# Altium project SVEC.PrjPcb (part 5 of 11)

## Sheet USB_interface.SchDoc: USB interface
size 420 x 297 mm; CheckedBy: T.Janicki; CompanyName: Creotech Instruments SA; DrawnBy: G. Kasprowicz; Organization: CERN; Address1: European Organization for Nuclear Research; Address2: CH-1211 Geneve 23 - Switzerland; DocumentNumber: 10; Revision: -; SheetNumber: 17; SheetTotal: 19; EDA_Number: EDA-xxxx; Projet: Simple VME FMC Carrier; CreateDate: 20/11/2012; CheckedDate: 23/01/2012; DivGrp: BE-CO; Designer: G.Kasprowicz; DocumentName: USB.SchDoc; ModifiedDate: -; Rule: PcbType=ProtelPcb
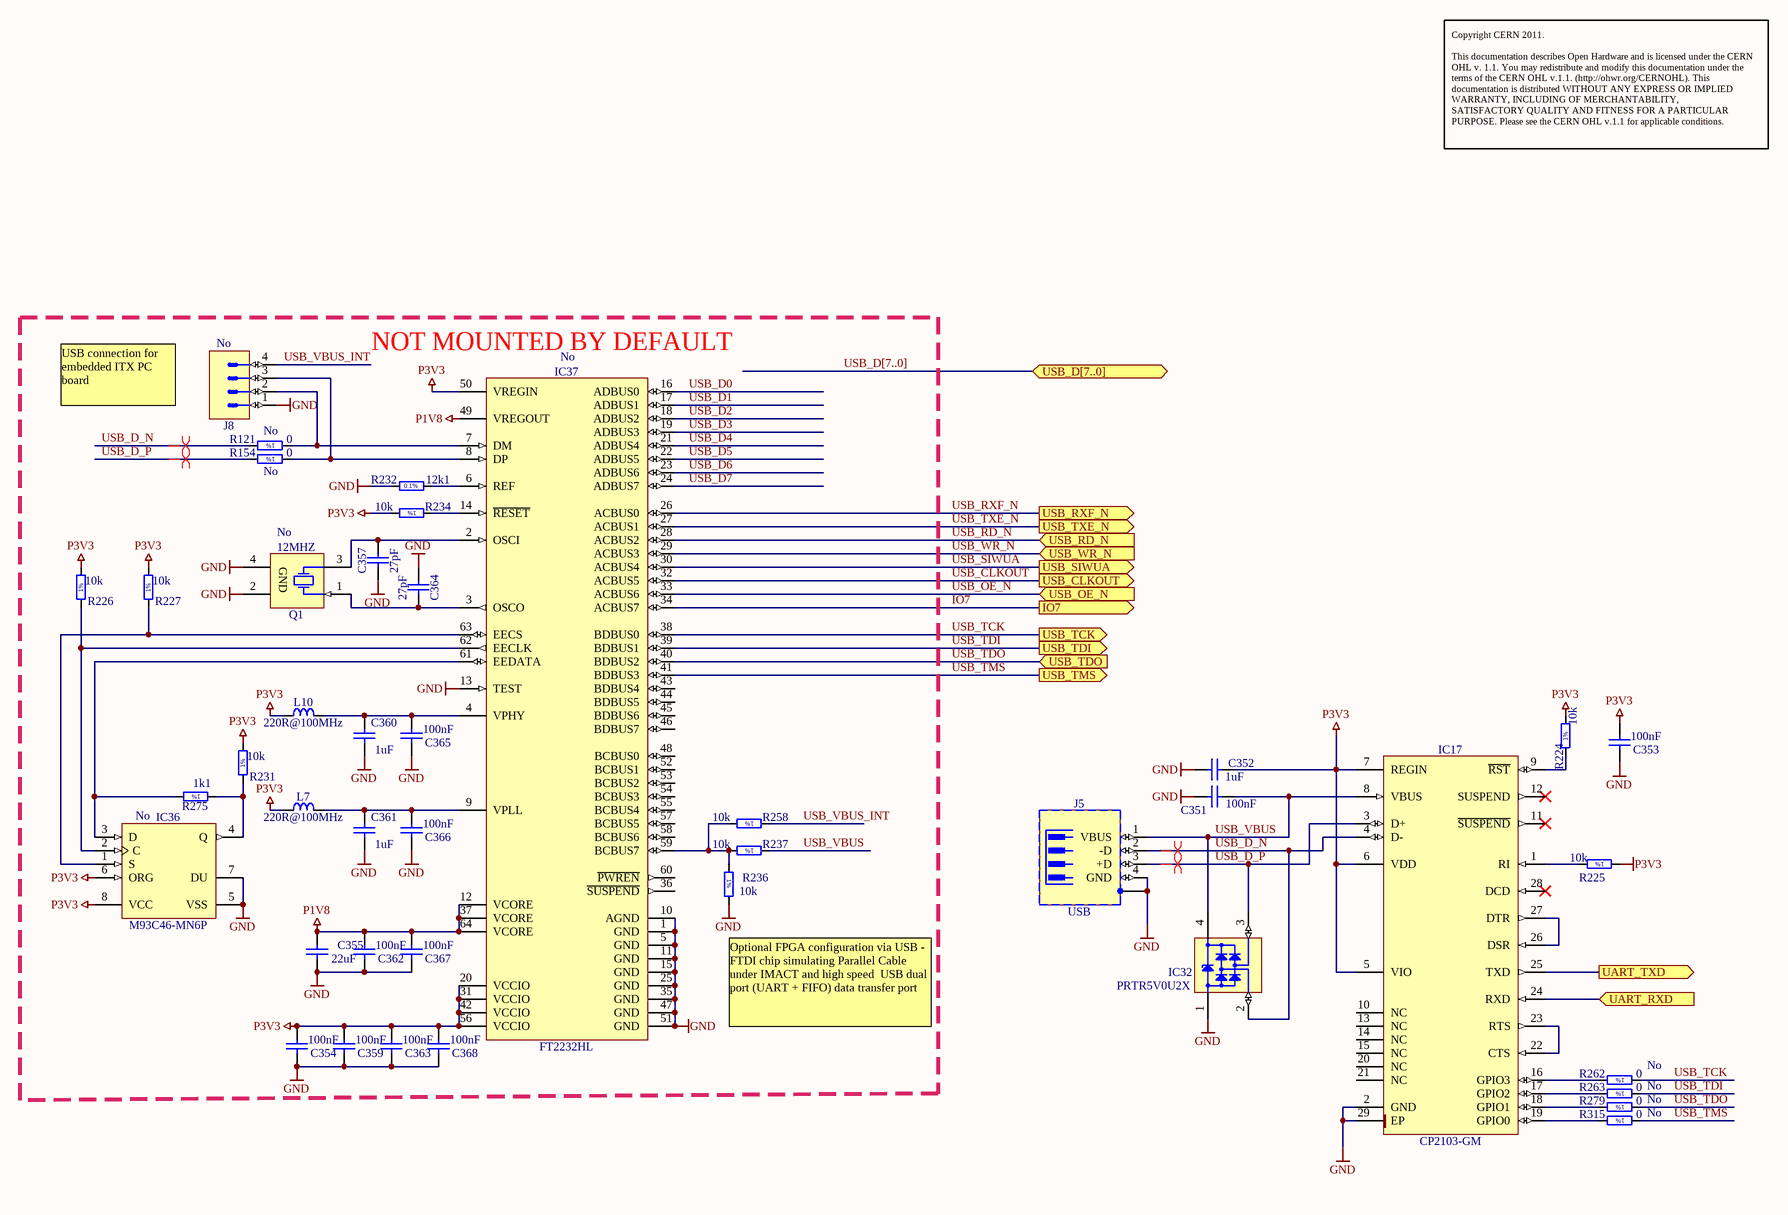
[diagram p6: USB_interface.SchDoc]

### Parts
C351  100nF  [CAPC1005X55N]
C352  1uF  [CAPC1608X87N]
C353  100nF  [CAPC1005X55N]
C354  100nF  [CAPC1005X55N]
C355  22uF  [CAPC3216X180N]
C357  27pF  [CAPC1608X87N]
C359  100nF  [CAPC1005X55N]
C360  1uF  [CAPC1608X87N]
C361  1uF  [CAPC1608X87N]
C362  100nF  [CAPC1005X55N]
C363  100nF  [CAPC1005X55N]
C364  27pF  [CAPC1608X87N]
C365  100nF  [CAPC1005X55N]
C366  100nF  [CAPC1005X55N]
C367  100nF  [CAPC1005X55N]
C368  100nF  [CAPC1005X55N]
IC17  CP2103-GM  [QFN50P500X500X100-29N-S335]
IC32  PRTR5V0U2X  [SOT190P230X110-4N]
IC36  M93C46-MN6P  Mounted: No  [SOIC127P600X175-8N]
IC37  FT2232HL  Mounted: No  [QFP50P1200X1200X160-64N]
J5  USB  [TYCO_292304-1]
J8  Mounted: No  [MOLEX_22-04-1041]  (hidden comment: KK®)
L7  220R@100MHz  [INDC2012X105N]
L10  220R@100MHz  [INDC2012X105N]
Q1  12MHZ  Mounted: No  [XTAL_ABRACON_ABM3B]
R121  0  Mounted: No  [RESC1608X55N]
R154  0  Mounted: No  [RESC1608X55N]
R224  10k  [RESC1608X55N]
R225  10k  [RESC1608X55N]
R226  10k  [RESC1608X55N]
R227  10k  [RESC1608X55N]
R231  10k  [RESC1608X55N]
R232  12k1  [RESC1608X55N]
R234  10k  [RESC1608X55N]
R236  10k  [RESC1608X55N]
R237  10k  [RESC1608X55N]
R258  10k  [RESC1608X55N]
R262  0  Mounted: No  [RESC1608X55N]
R263  0  Mounted: No  [RESC1608X55N]
R275  1k1  [RESC1608X55N]
R279  0  Mounted: No  [RESC1608X55N]
R315  0  Mounted: No  [RESC1608X55N]

### Blocks framed on the sheet
NOT MOUNTED BY DEFAULT: C354 C355 C357 C359-C368 IC36 IC37 J8 L7 L10 Q1 R121 R154 R226 R227 R231 R232 R234 R236 R237 R258 R275

### Ports
IO7 (out), UART_RXD (in), UART_TXD (out), USB_CLKOUT (out), USB_D[7..0] (bidir), USB_OE_N (in), USB_RD_N (in), USB_RXF_N (out), USB_SIWUA (out), USB_TCK (out), USB_TDI (out), USB_TDO (in), USB_TMS (out), USB_TXE_N (out), USB_WR_N (in)

### Nets
GND: C351.2 C352.2 C353.2 C354.2 C355.1 C357.1 C359.2 C360.1 C361.1 C362.2 C363.2 C364.1 C365.2 C366.2 C367.2 C368.2 IC17.2(GND) IC17.29(EP) IC32.1(GND) IC36.5(VSS) IC36.7(DU) IC37.1(GND) IC37.5(GND) IC37.10(AGND) IC37.11(GND) IC37.13(TEST) IC37.15(GND) IC37.25(GND) IC37.35(GND) IC37.47(GND) IC37.51(GND) J5.4(GND) J5.5(SH) J8.1 Q1.2(GND) Q1.4(GND) R232.1 R236.2
P1V8: C355.2 C362.1 C367.1 IC37.12(VCORE) IC37.37(VCORE) IC37.49(VREGOUT) IC37.64(VCORE)
P3V3: C352.1 C353.1 C354.1 C359.1 C363.1 C368.1 IC17.5(VIO) IC17.6(VDD) IC17.7(REGIN) IC36.6(ORG) IC36.8(VCC) IC37.20(VCCIO) IC37.31(VCCIO) IC37.42(VCCIO) IC37.50(VREGIN) IC37.56(VCCIO) L7.1 L10.1 R224.2 R225.1 R226.2 R227.2 R231.2 R234.2
IO7: IC37.34(ACBUS7) ; port IO7
UART_RXD: IC17.24(RXD) ; port UART_RXD
UART_TXD: IC17.25(TXD) ; port UART_TXD
USB_CLKOUT: IC37.32(ACBUS5) ; port USB_CLKOUT
USB_D0: IC37.16(ADBUS0)
USB_D1: IC37.17(ADBUS1)
USB_D2: IC37.18(ADBUS2)
USB_D3: IC37.19(ADBUS3)
USB_D4: IC37.21(ADBUS4)
USB_D5: IC37.22(ADBUS5)
USB_D6: IC37.23(ADBUS6)
USB_D7: IC37.24(ADBUS7)
USB_D_N: IC17.4(D-) IC32.2(I/O1) J5.2(-D) R121.2
USB_D_P: IC17.3(D+) IC32.3(I/O2) J5.3(+D) R154.2
USB_OE_N: IC37.33(ACBUS6) ; port USB_OE_N
USB_RD_N: IC37.28(ACBUS2) ; port USB_RD_N
USB_RXF_N: IC37.26(ACBUS0) ; port USB_RXF_N
USB_SIWUA: IC37.30(ACBUS4) ; port USB_SIWUA
USB_TCK: IC37.38(BDBUS0) R262.1 ; port USB_TCK
USB_TDI: IC37.39(BDBUS1) R263.1 ; port USB_TDI
USB_TDO: IC37.40(BDBUS2) R279.1 ; port USB_TDO
USB_TMS: IC37.41(BDBUS3) R315.1 ; port USB_TMS
USB_TXE_N: IC37.27(ACBUS1) ; port USB_TXE_N
USB_VBUS: C351.1 IC17.8(VBUS) IC32.4(VCC) J5.1(VBUS) R237.1
USB_VBUS_INT: J8.4 R258.1
USB_WR_N: IC37.29(ACBUS3) ; port USB_WR_N
NetC357_2: C357.2 IC37.2(OSCI) Q1.3(X)
NetC360_2: C360.2 C365.1 IC37.4(VPHY) L10.2
NetC361_2: C361.2 C366.1 IC37.9(VPLL) L7.2
NetC364_2: C364.2 IC37.3(OSCO) Q1.1(X)
NetIC17_1: IC17.1(RI) R225.2
NetIC17_9: IC17.9(~{RST}) R224.1
NetIC17_16: IC17.16(GPIO3) R262.2
NetIC17_17: IC17.17(GPIO2) R263.2
NetIC17_18: IC17.18(GPIO1) R279.2
NetIC17_19: IC17.19(GPIO0) R315.2
NetIC17_22: IC17.22(CTS) IC17.23(RTS)
NetIC17_26: IC17.26(DSR) IC17.27(DTR)
NetIC36_1: IC36.1(S) IC37.63(EECS) R227.1
NetIC36_2: IC36.2(C) IC37.62(EECLK) R226.1
NetIC36_3: IC36.3(D) IC37.61(EEDATA) R275.2
NetIC36_4: IC36.4(Q) R231.1 R275.1
NetIC37_6: IC37.6(REF) R232.2
NetIC37_7: IC37.7(DM) J8.2 R121.1
NetIC37_8: IC37.8(DP) J8.3 R154.1
NetIC37_14: IC37.14(~{RESET}) R234.1
NetIC37_59: IC37.59(BCBUS7) R236.1 R237.2 R258.2

Not connected (* = marked no-connect by the designer): IC17 10(NC) 11(~{SUSPEND})* 12(SUSPEND)* 13(NC) 14(NC) 15(NC) 20(NC) 21(NC) 28(DCD)*; IC37 36(~{SUSPEND}) 43(BDBUS4) 44(BDBUS5) 45(BDBUS6) 46(BDBUS7) 48(BCBUS0) 52(BCBUS1) 53(BCBUS2) 54(BCBUS3) 55(BCBUS4) 57(BCBUS5) 58(BCBUS6) 60(~{PWREN})

### Buses and harness runs
bus USB_D[7..0] = port USB_D[7..0]

### Layout directives
differential pair: USB_D_N, USB_D_P

### Notes on the sheet
- Copyright CERN 2011.
  This documentation describes Open Hardware and is licensed under the CERN OHL v. 1.1. You may redistribute and modify this documentation under the terms of the CERN OHL v.1.1. (http://ohwr.org/CERNOHL). This documentation is distributed WITHOUT ANY EXPRESS OR IMPLIED WARRANTY, INCLUDING OF MERCHANTABILITY, SATISFACTORY QUALITY AND FITNESS FOR A PARTICULAR PURPOSE. Please see the CERN OHL v.1.1 for applicable conditions.
- USB connection for embedded ITX PC board
- (near R236) Optional FPGA configuration via USB - FTDI chip simulating Parallel Cable under IMACT and high speed  USB dual port (UART + FIFO) data transfer port
- Project/Equipment
- Document
- Designer
- Drawn by
- Check.by
- File
- Last Mod.
- Print Date
- Sheet
- Size
- A3
- of
- Rev
- (in symbol R0603_0R_JUMPER) 1%
- (in symbol R0603_1K1_1%_0.1W_100PPM) 1%
- (in symbol R0603_10K_1%_0.1W_100PPM) 1%
- (in symbol R0603_12K1_0.1%_0.063W_10PPM) 0.1%

### Library data of the parts
C351 C353 = CC0402_100NF_16V_10%_X7R: Non-polarised capacitor; Part Description: SMD Multilayer Chip Ceramic Capacitor; Manufacturer: GENERIC; Manufacturer1 Part Number: 223878715649; Voltage: 16V; TC: X7R; Tolerance: ±10%; Table: Capacitors SMD; Part Number: CC0402_100NF_16V_10%_X7R; Component Kind: Standard; Component Type: Standard; Pin Count: 2; Value: 100nF; Status: Not Recommended; Manufacturer Part Number: CC0402_100NF_16V_10%_X7R; Case: 0402; Mounted: Yes; Socket: No; SMD: Yes; Manufacturer1 Example: PHYCOMP; Manufacturer1 ComponentHeight: 0.55mm; HelpURL: \\cern.ch\dfs\Applications\Altium\Datasheets\CC0402_X7R_PHYCOMP.pdf; Author: CERN DEM JLC; CreateDate: 03/12/2007; LatestRevisionDate: 03/12/2007
C352 = CC0603_1UF_16V_10%_X7R: Non-polarised capacitor; Part Description: SMD Multilayer Chip Ceramic Capacitor; Manufacturer: GENERIC; Manufacturer1 Part Number: 223824613663; Voltage: 16V; TC: X7R; Tolerance: ±10%; Table: Capacitors SMD; Part Number: CC0603_1UF_16V_10%_X7R; Component Kind: Standard; Component Type: Standard; Pin Count: 2; Value: 1uF; Status: Preferred; Manufacturer Part Number: CC0603_1uF_16V_10%_X7R; Case: 0603; Mounted: Yes; Socket: No; SMD: Yes; Manufacturer1 Example: PHYCOMP; Manufacturer1 ComponentHeight: 0.87mm; HelpURL: \\cern.ch\dfs\Applications\Altium\Datasheets\CC0805_X5R_PHYCOMP_HC.pdf; Author: CERN DEM JLC; CreateDate: 12/3/2007; LatestRevisionDate: 12/3/2007
C354 C359 C362 C363 C365-C368 = CC0402_100NF_16V_10%_X7R: Non-polarised capacitor; Part Description: SMD Multilayer Chip Ceramic Capacitor; Manufacturer: GENERIC; Manufacturer1 Part Number: 223878715649; Voltage: 16V; TC: X7R; Tolerance: ±10%; Mounted: No; Table: Capacitors SMD; Part Number: CC0402_100NF_16V_10%_X7R; Component Kind: Standard; Component Type: Standard; Pin Count: 2; Value: 100nF; Status: Not Recommended; Manufacturer Part Number: CC0402_100NF_16V_10%_X7R; Case: 0402; Socket: No; SMD: Yes; Manufacturer1 Example: PHYCOMP; Manufacturer1 ComponentHeight: 0.55mm; HelpURL: \\cern.ch\dfs\Applications\Altium\Datasheets\CC0402_X7R_PHYCOMP.pdf; Author: CERN DEM JLC; CreateDate: 03/12/2007; LatestRevisionDate: 03/12/2007
C355 = CC1206_22UF_10V_10%_X7R: Non-polarised capacitor; Part Description: SMD Multilayer Chip Ceramic Capacitor; Manufacturer: GENERIC; Manufacturer1 Part Number: GRM31CR71A226KE15L; Voltage: 10V; TC: X7R; Tolerance: ±10%; Mounted: No; Table: Capacitors SMD; Part Number: CC1206_22UF_10V_10%_X7R; Component Kind: Standard; Component Type: Standard; Pin Count: 2; Value: 22uF; Status: Preferred; Manufacturer Part Number: CC1206_22UF_10V_10%_X7R; Case: 1206; Socket: No; SMD: Yes; Manufacturer1 Example: MURATA; Manufacturer1 ComponentHeight: 1.8mm; HelpURL: \\cern.ch\dfs\Applications\Altium\Datasheets\CC1206_X7R_MURATA_GRM-HI-CAP.pdf; Author: CERN DEM JLC; CreateDate: 2010-06-08; LatestRevisionDate: 2010-06-08
C357 C364 = CC0603_27PF_50V_5%_NP0: Non-polarised capacitor; Part Description: SMD Multilayer Chip Ceramic Capacitor; Manufacturer: GENERIC; Manufacturer1 Part Number: 223886715279; Voltage: 50V; TC: NP0; Tolerance: ±5%; Mounted: No; Table: Capacitors SMD; Part Number: CC0603_27PF_50V_5%_NP0; Component Kind: Standard; Component Type: Standard; Pin Count: 2; Value: 27pF; Status: Preferred; Manufacturer Part Number: CC0603_27PF_50V_5%_NP0; Case: 0603; Socket: No; SMD: Yes; Manufacturer1 Example: PHYCOMP; Manufacturer1 ComponentHeight: 0.87mm; HelpURL: \\cern.ch\dfs\Applications\Altium\Datasheets\CC0603_NP0_PHYCOMP.pdf; Author: CERN DEM JLC; CreateDate: 2007-12-03; LatestRevisionDate: 2007-12-03
C360 C361 = CC0603_1UF_16V_10%_X7R: Non-polarised capacitor; Part Description: SMD Multilayer Chip Ceramic Capacitor; Manufacturer: GENERIC; Manufacturer1 Part Number: 223824613663; Voltage: 16V; TC: X7R; Tolerance: ±10%; Mounted: No; Table: Capacitors SMD; Part Number: CC0603_1UF_16V_10%_X7R; Component Kind: Standard; Component Type: Standard; Pin Count: 2; Value: 1uF; Status: Preferred; Manufacturer Part Number: CC0603_1uF_16V_10%_X7R; Case: 0603; Socket: No; SMD: Yes; Manufacturer1 Example: PHYCOMP; Manufacturer1 ComponentHeight: 0.87mm; HelpURL: \\cern.ch\dfs\Applications\Altium\Datasheets\CC0805_X5R_PHYCOMP_HC.pdf; Author: CERN DEM JLC; CreateDate: 03/12/2007; LatestRevisionDate: 03/12/2007
IC17 = CP2103-GM: Single-Chip USB to UART Bridge; Manufacturer: SILICON LABS; Table: Analog & Interface; Part Number: CP2103-GM; Component Kind: Standard; Component Type: Standard; Device: CP2103-GM; PackageDescription: QFN, 0.50mm Pitch, Square; 28 pin, 5.00mm L X 5.00mm W X 1.00mm H body (w/thermal tab 3.35 X 3.35mm),  IPC Medium Density; Part Description: Single-Chip USB to UART Bridge; Manufacturer Part Number: CP2103-GM; Pin Count: 29; Case: QFN28; Mounted: Yes; Socket: No; SMD: Yes; ComponentHeight: 1.0mm; Author: CERN DEM JLC; HelpURL: \\cern.ch\dfs\Applications\Altium\Datasheets\CP2103-GM.pdf; CreateDate: 2011-08-17; LatestRevisionDate: 2011-08-17
IC32 = PRTR5V0U2X: Ultra Low Capacitance Double Rail-to-Rail ESD Protection Diode; Part Description: Ultra Low Capacitance (1pF) Double Rail-to-Rail ESD Protection Diode (8kV); Manufacturer: PHILIPS NXP; Voltage: 5.5V; Table: Diodes; Part Number: PRTR5V0U2X; Component Kind: Standard; Component Type: Standard; Device: PRTR5V0U2X; PackageDescription: SOT143B, SOT, 1.90mm Pitch; 4 Pin, 1.30mm W X 2.90mm L X 1.10mm H body, IPC Medium Density; Manufacturer Part Number: PRTR5V0U2X; Pin Count: 4; Case: SOT143B; Mounted: Yes; Socket: No; SMD: Yes; ComponentHeight: 1.1mm; HelpURL: \\cern.ch\dfs\Applications\Altium\Datasheets\PRTR5V0U2X.pdf; Author: CERN DEM JLC; CreateDate: 3/22/2011; LatestRevisionDate: 3/22/2011
IC36 = M93C46-MN6P: 1Kb (x8/x16) Serial Microwire Bus EEPROM; Part Description: 1K (128 x 8 or 64 x 16 bit) Serial Microwire Bus EEPROM; Manufacturer: ST MICROELECTRONICS; Table: Logic; Part Number: M93C46-MN6P; Component Kind: Standard; Component Type: Standard; Device: M93C46-MN6P; PackageDescription: SOIC 8, Pitch 1.27mm - Body 4x5mm, IPC Medium Density; Manufacturer Part Number: M93C46-MN6P; Pin Count: 8; Case: SOIC8; Socket: No; SMD: Yes; ComponentHeight: 1.75mm; HelpURL: \\cern.ch\dfs\Applications\Altium\Datasheets\M93C46-MN6P.pdf; Author: CERN DEM JLC; CreateDate: 2008-09-09; LatestRevisionDate: 2008-09-09
IC37 = FT2232HL: Dual High Speed USB to Multipurpose UART/FIFO IC; Manufacturer: FUTURE TECHNOLOGY DEVICES INTERNATIONAL (FTDI); Table: Analog & Interface; Part Number: FT2232HL; Component Kind: Standard; Component Type: Standard; Device: FT2232HL; PackageDescription: QFP, 0.50mm pitch, square; 16 pin X 16 pin, 10.00mm X 10.00mm X 1.60mm Body, IPC Medium Density; Part Description: Dual High Speed USB to Multipurpose UART/FIFO IC; Manufacturer Part Number: FT2232HL; Pin Count: 64; Case: QFP64; Socket: No; SMD: Yes; ComponentHeight: 1.6mm; Author: CERN DEM JLC; HelpURL: \\cern.ch\dfs\Applications\Altium\Datasheets\FT2232HL.pdf; CreateDate: 2011-12-06; LatestRevisionDate: 2011-12-06
J5 = TYCO_292304-1: 4 Pin + 1 Shield USB Receptacle; Part Description: Thru Hole, Right Angle, 4 Position, Type B, USB Receptacle; Manufacturer: TYCO ELECTRONICS; Table: TYCO; Part Number: TYCO_292304-1; Component Kind: Standard; Component Type: Standard; Pin Count: 5; Family: USB; Mounted: Yes; Socket: No; SMD: No; Status: None; Manufacturer Part Number: 292304-1; ComponentHeight: 11.5mm; HelpURL: \\cern.ch\dfs\Applications\Altium\Datasheets\TYCO_292304-1.pdf; Author: CERN DEM JLC; CreateDate: 2010-07-16; LatestRevisionDate: 2010-07-16
J8 = MOLEX_22-04-1041: Connector 4 Male; Part Description: 2.5mm (.100") Pitch KK® Wire-to-Board Header, Vertical, with Friction Lock, 4 Circuits, Tin (Sn) Plating; Manufacturer: MOLEX; Part Number: MOLEX_22-04-1041; Component Kind: Standard; Component Type: Standard; Pin Count: 4; Family: KK®; Socket: No; SMD: No; Status: None; Manufacturer Part Number: 22-04-1041; ComponentHeight: 11.7mm; HelpURL: \\cern.ch\dfs\Applications\Altium\Datasheets\MOLEX_22-04-1041.pdf; Author: CERN DEM JLC; CreateDate: 2012-02-09; LatestRevisionDate: 2012-02-09; Table: MOLEX
L7 L10 = IND0805_MURATA_BLM21PG221SN1D: Inductor; Part Description: SMD EMIFIL Suppression Chip Bead Ferrite; Manufacturer: MURATA; Power: 2A; Resistance: 0.05R; Tolerance: ±25%; Mounted: No; Table: Inductors SMD; Part Number: IND0805_MURATA_BLM21PG221SN1D; Component Kind: Standard; Component Type: Standard; Pin Count: 2; Value: 220R@100MHz; Status: None; Manufacturer Part Number: BLM21PG221SN1D; Case: 0805; Socket: No; SMD: Yes; ComponentHeight: 1.05mm; HelpURL: \\cern.ch\dfs\Applications\Altium\Datasheets\IND0402_MURATA_BLM21P.pdf; Author: CERN DEM JLC; CreateDate: 25/01/2010; LatestRevisionDate: 25/01/2010
Q1 = XTAL_12MHZ_ABRACON_ABM3B-12.000MHZ-B2-T: Crystal 4 pins 1=XTAL Control 2=GND3=XTAL 4=GND; Part Description: Tolerance:± 20ppm, Stability:± 50ppm, -20°C to +70°C, 18pF, Ceramic SMD Crystal, ABM3B Serie; Table: Crystals & Oscillators; Part Number: XTAL_12MHZ_ABRACON_ABM3B-12.000MHZ-B2-T; Component Kind: Standard; Component Type: Standard; PackageDescription: ABM3B Serie, SMD Cristal, Body 5.x3.2mm; Value: 12MHZ; Manufacturer: ABRACON; Manufacturer Part Number: ABM3B-12.000MHZ-B2-T; Pin Count: 2; Socket: No; SMD: Yes; ComponentHeight: 1.1mm; HelpURL: \\cern.ch\dfs\Applications\Altium\Datasheets\XTAL_ABRACON_ABM3B.pdf; Author: CERN DEM JLC; CreateDate: 2012-03-06; LatestRevisionDate: 2012-03-06
R121 R154 R262 R263 R279 R315 = R0603_0R_JUMPER: Resistor - 1%; Part Description: 1A (0.05R Max DC Resistance) Zero Ohm Jumper; Manufacturer: GENERIC; Manufacturer1 Part Number: NRC06Z0; Table: Resistors SMD; Part Number: R0603_0R_JUMPER; Component Kind: Standard; Component Type: Standard; Pin Count: 2; Value: 0; Status: Preferred; Manufacturer Part Number: R0603_0R_JUMPER; Case: 0603; Socket: No; SMD: Yes; Manufacturer1 Example: NIC COMPONENT; Manufacturer1 ComponentHeight: 0.55mm; HelpURL: \\cern.ch\dfs\Applications\Altium\Datasheets\R0603_NIC_NRC.pdf; Author: CERN DEM JLC; CreateDate: 12/3/2007; LatestRevisionDate: 3/13/2008
R224 R225 = R0603_10K_1%_0.1W_100PPM: Resistor - 1%; Part Description: General Purpose Thick Film Chip Resistor; Manufacturer: GENERIC; Manufacturer1 Part Number: NRC06F1002TRF; Power: 0.1W; TC: ±100ppm/°C; Table: Resistors SMD; Part Number: R0603_10K_1%_0.1W_100PPM; Component Kind: Standard; Component Type: Standard; Pin Count: 2; Value: 10k; Status: Preferred; Tolerance: ±1%; Manufacturer Part Number: R0603_10K_1%_0.1W_100PPM; Case: 0603; Mounted: Yes; Socket: No; SMD: Yes; Manufacturer1 Example: NIC COMPONENT; Manufacturer1 ComponentHeight: 0.55mm; HelpURL: \\cern.ch\dfs\Applications\Altium\Datasheets\R0603_NIC_NRC.pdf; Author: CERN DEM JLC; CreateDate: 12/3/2007; LatestRevisionDate: 3/13/2008
R226 R227 R231 R234 R236 R237 R258 = R0603_10K_1%_0.1W_100PPM: Resistor - 1%; Part Description: General Purpose Thick Film Chip Resistor; Manufacturer: GENERIC; Manufacturer1 Part Number: NRC06F1002TRF; Power: 0.1W; TC: ±100ppm/°C; Mounted: No; Table: Resistors SMD; Part Number: R0603_10K_1%_0.1W_100PPM; Component Kind: Standard; Component Type: Standard; Pin Count: 2; Value: 10k; Status: Preferred; Tolerance: ±1%; Manufacturer Part Number: R0603_10K_1%_0.1W_100PPM; Case: 0603; Socket: No; SMD: Yes; Manufacturer1 Example: NIC COMPONENT; Manufacturer1 ComponentHeight: 0.55mm; HelpURL: \\cern.ch\dfs\Applications\Altium\Datasheets\R0603_NIC_NRC.pdf; Author: CERN DEM JLC; CreateDate: 12/3/2007; LatestRevisionDate: 3/13/2008
R232 = R0603_12K1_0.1%_0.063W_10PPM: Resistor - 0.1%; Part Description: Thin Film Chip Resistor; Manufacturer: GENERIC; Manufacturer1 Part Number: RN73C1J12K1BTDF; Power: 0.063W; TC: ±10ppm; Mounted: No; Table: Resistors SMD; Part Number: R0603_12K1_0.1%_0.063W_10PPM; Component Kind: Standard; Component Type: Standard; Pin Count: 2; Value: 12k1; Status: Not recommended; Tolerance: ±0.1%; Manufacturer Part Number: R0603_12K1_0.1%_0.063W_10PPM; Case: 0603; Socket: No; SMD: Yes; Manufacturer1 Example: TYCO HOLSWORTHY; Manufacturer1 ComponentHeight: 0.5mm; HelpURL: \\cern.ch\dfs\Applications\Altium\Datasheets\R0603_Tyco_RN73.pdf; Author: CERN DEM JLC; CreateDate: 2007-12-03; LatestRevisionDate: 2008-03-13
R275 = R0603_1K1_1%_0.1W_100PPM: Resistor - 1%; Part Description: General Purpose Thick Film Chip Resistor; Manufacturer: GENERIC; Manufacturer1 Part Number: NRC06F1101TRF; Power: 0.1W; TC: ±100ppm/°C; Mounted: No; Table: Resistors SMD; Part Number: R0603_1K1_1%_0.1W_100PPM; Component Kind: Standard; Component Type: Standard; Pin Count: 2; Value: 1k1; Status: Preferred; Tolerance: ±1%; Manufacturer Part Number: R0603_1K1_1%_0.1W_100PPM; Case: 0603; Socket: No; SMD: Yes; Manufacturer1 Example: NIC COMPONENT; Manufacturer1 ComponentHeight: 0.55mm; HelpURL: \\cern.ch\dfs\Applications\Altium\Datasheets\R0603_NIC_NRC.pdf; Author: CERN DEM JLC; CreateDate: 2007-12-03; LatestRevisionDate: 2008-03-13

## Sheet AFPGA.SchDoc: Application FPGA
size 420 x 297 mm; CheckedBy: T.Janicki; CompanyName: Creotech Instruments SA; DrawnBy: G.Kasprowicz; Organization: CERN; Address1: European Organization for Nuclear Research; Address2: CH-1211 Geneve 23 - Switzerland; Revision: -; SheetNumber: 2; SheetTotal: 21; EDA_Number: EDA-xxxx; Projet: Simple VME FMC Carrier; ModifiedBy: -; CreateDate: 20/11/2012; CheckedDate: 30/04/2012; DivGrp: BE-CO; Designer: G.Kasprowicz; PageSetup: Record=PageOptions|CenterHorizontal=True|CenterVertical=True|PrintScale=0.95|XCorrection=1.00|YCorrection=1.00|PrintKind=1|BorderSize=5000000|LeftOffset=0|BottomOffset=0|Orientation=2|PaperLength=1000|PaperWidth=1000|Scale=100|PaperSource=15|PrintQuality=600|MediaType=1|DitherType=10|PaperKind=A3|PrintScaleMode=1; ModifiedDate: -
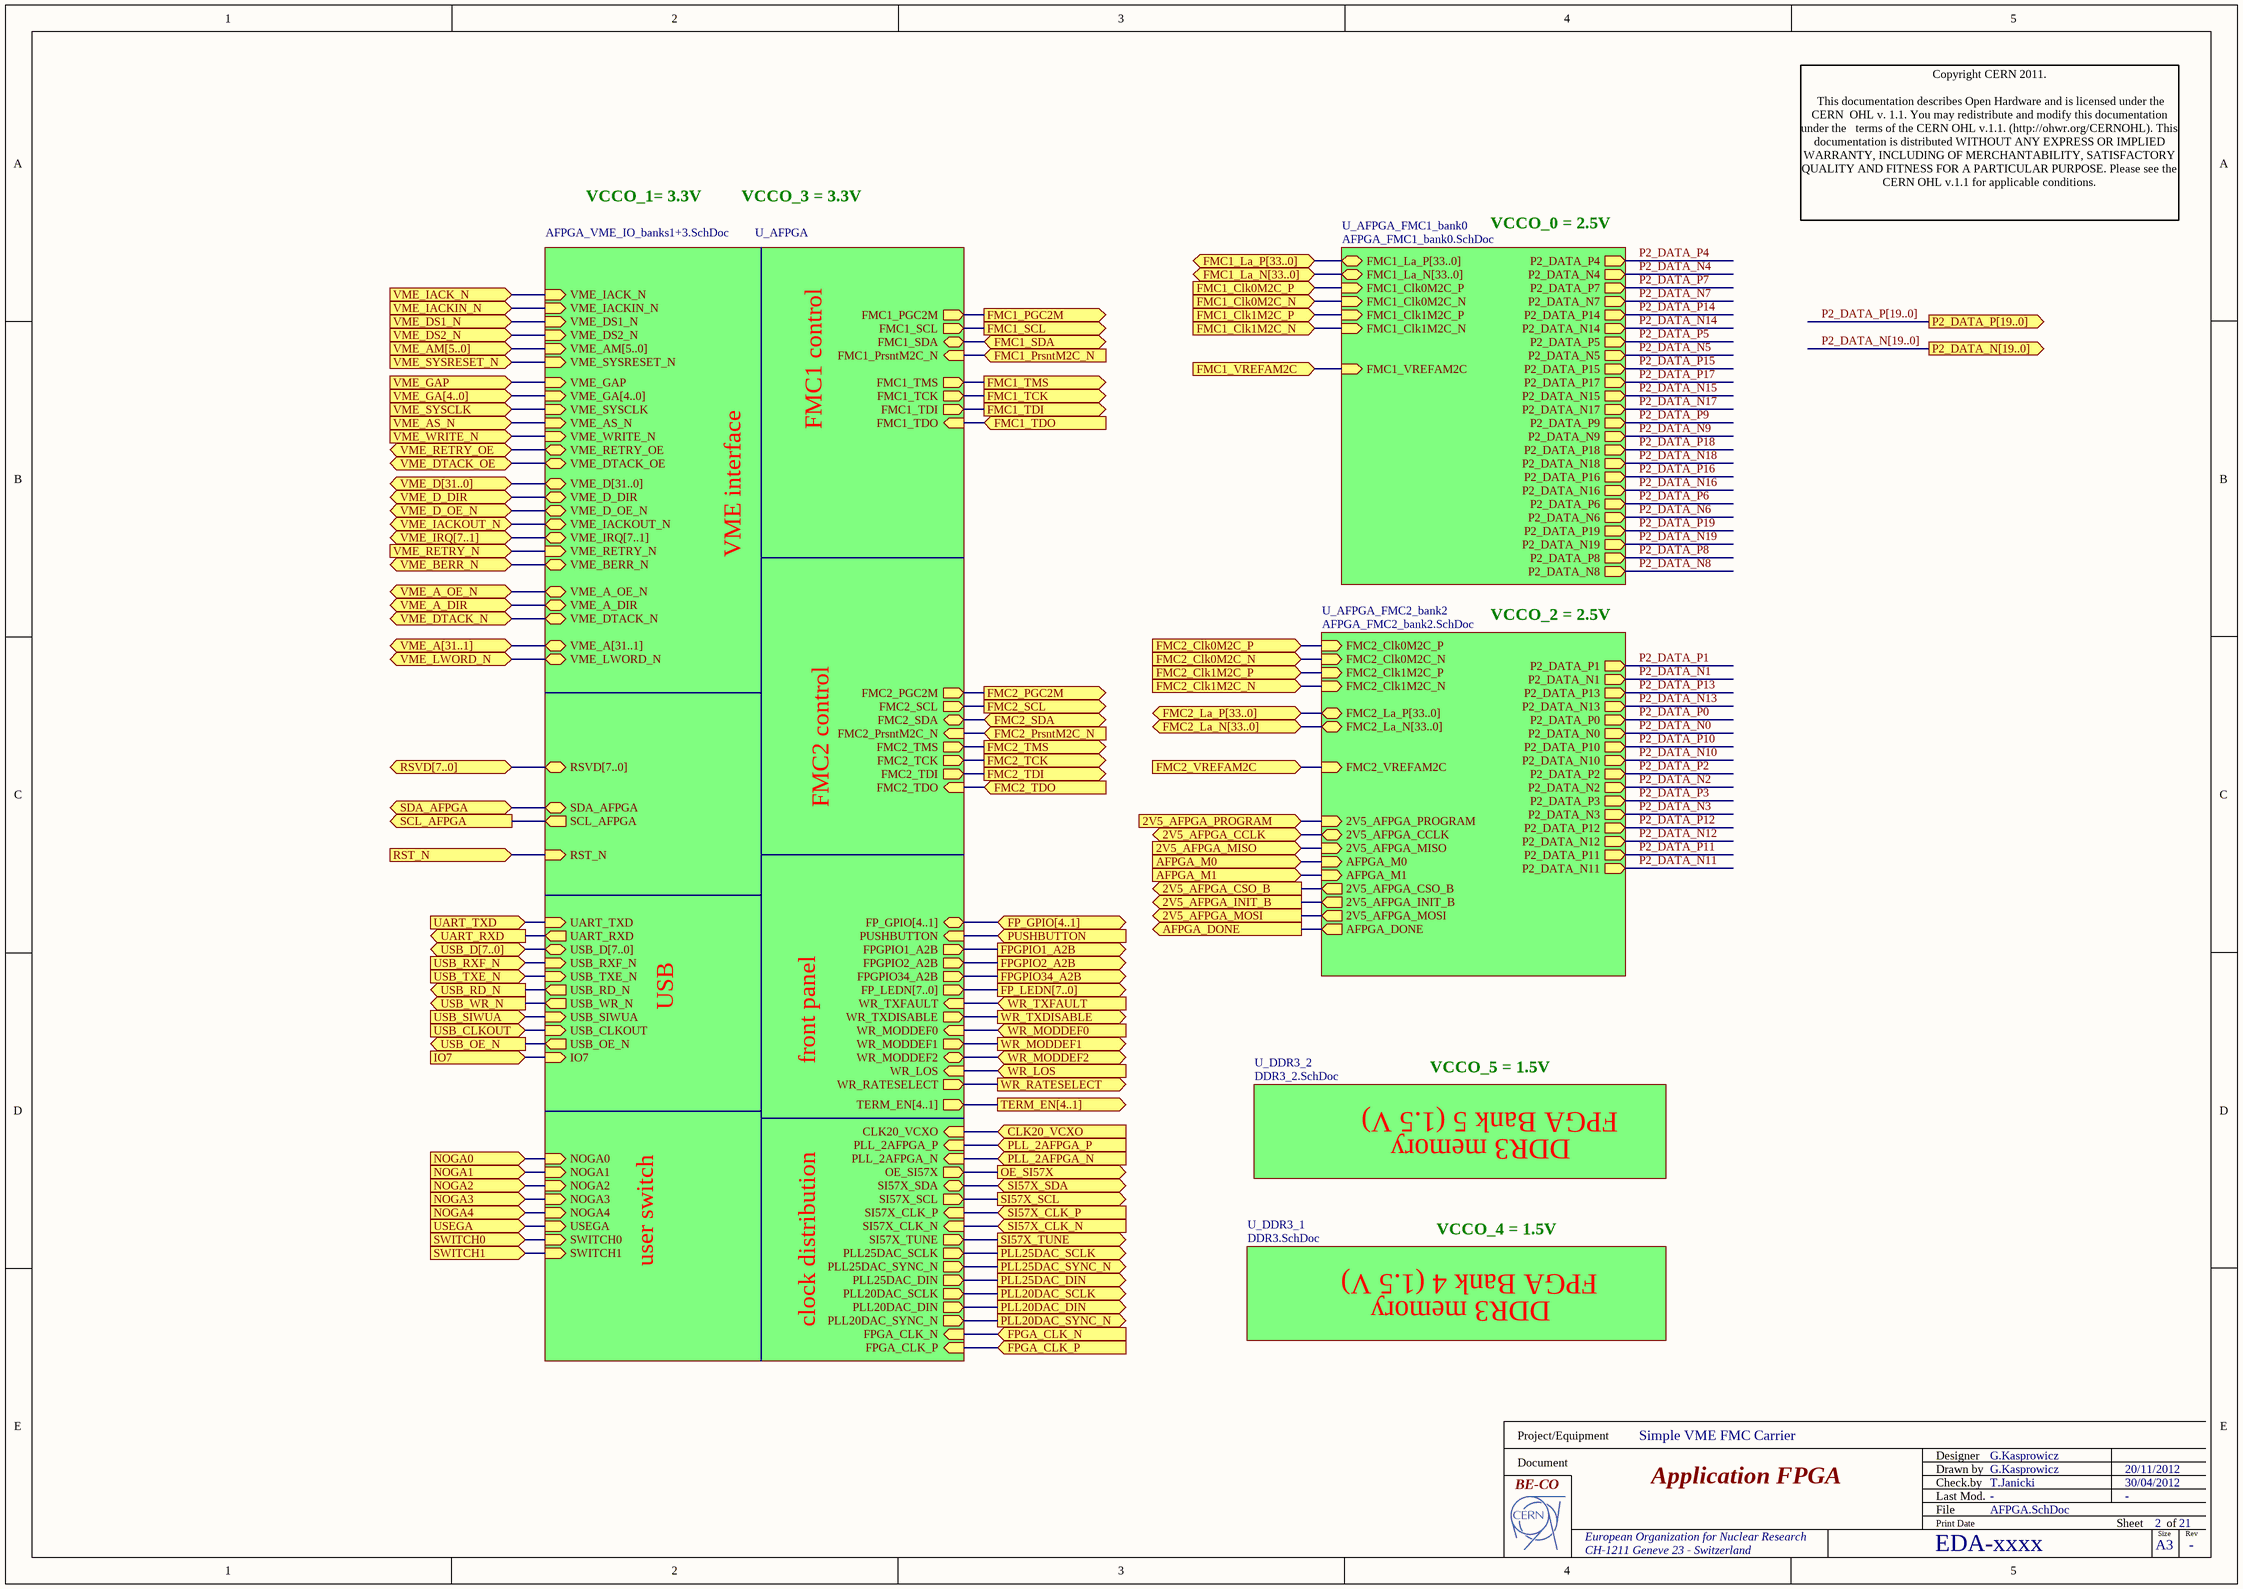
[diagram p7: AFPGA.SchDoc]

### Sub-sheets
U_AFPGA = AFPGA_VME_IO_banks1+3.SchDoc: UART_TXD (in), UART_RXD (out), USB_D[7..0] (bidir), USB_RXF_N (in), USB_TXE_N (in), USB_RD_N (out), USB_WR_N (out), USB_SIWUA (in), USB_CLKOUT (in), USB_OE_N (out), IO7 (in), RST_N (in), PUSHBUTTON (in), WR_TXFAULT (in), WR_TXDISABLE (out), WR_MODDEF0 (in), WR_MODDEF1 (out), WR_MODDEF2 (bidir), WR_LOS (in), WR_RATESELECT (out), FP_LEDN[7..0] (out), FPGPIO1_A2B (out), FPGPIO2_A2B (out), FPGPIO34_A2B (out), FP_GPIO[4..1] (bidir), PLL_2AFPGA_P (in), PLL_2AFPGA_N (in), SI57X_SDA (bidir), SI57X_CLK_P (in), SI57X_CLK_N (in), SI57X_SCL (out), OE_SI57X (out), SI57X_TUNE (out), PLL25DAC_SCLK (out), PLL25DAC_DIN (out), CLK20_VCXO (in), FPGA_CLK_P (in), FPGA_CLK_N (in), NOGA0 (in), NOGA1 (in), NOGA2 (in), NOGA3 (in), NOGA4 (in), USEGA (in), SWITCH0 (in), SWITCH1 (in), TERM_EN[4..1] (out), PLL25DAC_SYNC_N (out), PLL20DAC_SCLK (out), PLL20DAC_DIN (out), PLL20DAC_SYNC_N (out), SDA_AFPGA (bidir), SCL_AFPGA (out), VME_D_DIR (bidir), VME_D_OE_N (bidir), VME_IACKOUT_N (bidir), VME_RETRY_N (in), VME_BERR_N (bidir), VME_A_OE_N (bidir), VME_A_DIR (bidir), VME_DTACK_N (bidir), VME_LWORD_N (bidir), VME_A[31..1] (bidir), VME_IRQ[7..1] (bidir), VME_D[31..0] (bidir), RSVD[7..0] (bidir), VME_RETRY_OE (bidir), VME_DTACK_OE (bidir), VME_SYSCLK (in), VME_AS_N (in), VME_WRITE_N (in), VME_GAP (in), VME_GA[4..0] (in), VME_IACK_N (in), VME_IACKIN_N (in), VME_SYSRESET_N (in), VME_AM[5..0] (in), VME_DS1_N (in), VME_DS2_N (in), FMC1_PGC2M (out), FMC1_SCL (out), FMC1_SDA (bidir), FMC1_PrsntM2C_N (in), FMC1_TMS (out), FMC1_TCK (out), FMC1_TDI (out), FMC1_TDO (in), FMC2_PGC2M (out), FMC2_SCL (out), FMC2_SDA (bidir), FMC2_PrsntM2C_N (in), FMC2_TMS (out), FMC2_TCK (out), FMC2_TDI (out), FMC2_TDO (in)
U_AFPGA_FMC1_bank0 = AFPGA_FMC1_bank0.SchDoc: FMC1_La_P[33..0] (bidir), FMC1_La_N[33..0] (bidir), FMC1_Clk0M2C_P (in), FMC1_Clk0M2C_N (in), FMC1_Clk1M2C_P (in), FMC1_Clk1M2C_N (in), FMC1_VREFAM2C (in), P2_DATA_P4 (out), P2_DATA_N4 (out), P2_DATA_P7 (out), P2_DATA_N7 (out), P2_DATA_P14 (out), P2_DATA_N14 (out), P2_DATA_P5 (out), P2_DATA_N5 (out), P2_DATA_P15 (out), P2_DATA_P17 (out), P2_DATA_N15 (out), P2_DATA_N17 (out), P2_DATA_P9 (out), P2_DATA_N9 (out), P2_DATA_P18 (out), P2_DATA_N18 (out), P2_DATA_P16 (out), P2_DATA_N16 (out), P2_DATA_P6 (out), P2_DATA_N6 (out), P2_DATA_P19 (out), P2_DATA_N19 (out), P2_DATA_P8 (out), P2_DATA_N8 (out)
U_AFPGA_FMC2_bank2 = AFPGA_FMC2_bank2.SchDoc: FMC2_Clk0M2C_P (in), FMC2_Clk0M2C_N (in), FMC2_Clk1M2C_P (in), FMC2_Clk1M2C_N (in), 2V5_AFPGA_PROGRAM (in), FMC2_La_P[33..0] (bidir), FMC2_La_N[33..0] (bidir), 2V5_AFPGA_CCLK (bidir), 2V5_AFPGA_MISO (in), AFPGA_M0 (in), AFPGA_M1 (in), FMC2_VREFAM2C (in), 2V5_AFPGA_CSO_B (out), 2V5_AFPGA_INIT_B (out), 2V5_AFPGA_MOSI (out), AFPGA_DONE (out), P2_DATA_P1 (out), P2_DATA_N1 (out), P2_DATA_P13 (out), P2_DATA_N13 (out), P2_DATA_P0 (out), P2_DATA_N0 (out), P2_DATA_P10 (out), P2_DATA_N10 (out), P2_DATA_P2 (out), P2_DATA_N2 (out), P2_DATA_P3 (out), P2_DATA_N3 (out), P2_DATA_P12 (out), P2_DATA_N12 (out), P2_DATA_P11 (out), P2_DATA_N11 (out)
U_DDR3_1 = DDR3.SchDoc: no entries
U_DDR3_2 = DDR3_2.SchDoc: no entries

### Ports
2V5_AFPGA_CCLK (bidir), 2V5_AFPGA_CSO_B (out), 2V5_AFPGA_INIT_B (out), 2V5_AFPGA_MISO (in), 2V5_AFPGA_MOSI (out), 2V5_AFPGA_PROGRAM (in), AFPGA_DONE (out), AFPGA_M0 (in), AFPGA_M1 (in), CLK20_VCXO (in), FMC1_Clk0M2C_N (in), FMC1_Clk0M2C_P (in), FMC1_Clk1M2C_N (in), FMC1_Clk1M2C_P (in), FMC1_La_N[33..0] (bidir), FMC1_La_P[33..0] (bidir), FMC1_PGC2M (out), FMC1_PrsntM2C_N (in), FMC1_SCL (out), FMC1_SDA (bidir), FMC1_TCK (out), FMC1_TDI (out), FMC1_TDO (in), FMC1_TMS (out), FMC1_VREFAM2C (in), FMC2_Clk0M2C_N (in), FMC2_Clk0M2C_P (in), FMC2_Clk1M2C_N (in), FMC2_Clk1M2C_P (in), FMC2_La_N[33..0] (bidir), FMC2_La_P[33..0] (bidir), FMC2_PGC2M (out), FMC2_PrsntM2C_N (in), FMC2_SCL (out), FMC2_SDA (bidir), FMC2_TCK (out), FMC2_TDI (out), FMC2_TDO (in), FMC2_TMS (out), FMC2_VREFAM2C (in), FP_GPIO[4..1] (bidir), FP_LEDN[7..0] (out), FPGA_CLK_N (in), FPGA_CLK_P (in), FPGPIO1_A2B (out), FPGPIO2_A2B (out), FPGPIO34_A2B (out), IO7 (in), NOGA0 (in), NOGA1 (in), NOGA2 (in), NOGA3 (in), NOGA4 (in), OE_SI57X (out), P2_DATA_N[19..0] (out), P2_DATA_P[19..0] (out), PLL20DAC_DIN (out), PLL20DAC_SCLK (out), PLL20DAC_SYNC_N (out), PLL25DAC_DIN (out), PLL25DAC_SCLK (out), PLL25DAC_SYNC_N (out), PLL_2AFPGA_N (in), PLL_2AFPGA_P (in), PUSHBUTTON (in), RST_N (in), RSVD[7..0] (bidir), SCL_AFPGA (out), SDA_AFPGA (bidir), SI57X_CLK_N (in), SI57X_CLK_P (in), SI57X_SCL (out), SI57X_SDA (bidir), SI57X_TUNE (out), SWITCH0 (in), SWITCH1 (in), TERM_EN[4..1] (out), UART_RXD (out), UART_TXD (in), USB_CLKOUT (in), USB_D[7..0] (bidir), USB_OE_N (out), USB_RD_N (out), USB_RXF_N (in), USB_SIWUA (in), USB_TXE_N (in), USB_WR_N (out), USEGA (in), VME_A[31..1] (bidir), VME_A_DIR (bidir), VME_A_OE_N (bidir), VME_AM[5..0] (in), VME_AS_N (in), VME_BERR_N (bidir), VME_D[31..0] (bidir), VME_D_DIR (bidir), VME_D_OE_N (bidir), VME_DS1_N (in), VME_DS2_N (in), VME_DTACK_N (bidir), VME_DTACK_OE (bidir), VME_GA[4..0] (in), VME_GAP (in), VME_IACK_N (in), VME_IACKIN_N (in), VME_IACKOUT_N (bidir), VME_IRQ[7..1] (bidir), VME_LWORD_N (bidir), VME_RETRY_N (in), VME_RETRY_OE (bidir), VME_SYSCLK (in), VME_SYSRESET_N (in), VME_WRITE_N (in), WR_LOS (in), WR_MODDEF0 (in), WR_MODDEF1 (out), WR_MODDEF2 (bidir), WR_RATESELECT (out), WR_TXDISABLE (out), WR_TXFAULT (in)

### Nets
2V5_AFPGA_CCLK: port 2V5_AFPGA_CCLK, sheet U_AFPGA_FMC2_bank2/2V5_AFPGA_CCLK
2V5_AFPGA_CSO_B: port 2V5_AFPGA_CSO_B, sheet U_AFPGA_FMC2_bank2/2V5_AFPGA_CSO_B
2V5_AFPGA_INIT_B: port 2V5_AFPGA_INIT_B, sheet U_AFPGA_FMC2_bank2/2V5_AFPGA_INIT_B
2V5_AFPGA_MISO: port 2V5_AFPGA_MISO, sheet U_AFPGA_FMC2_bank2/2V5_AFPGA_MISO
2V5_AFPGA_MOSI: port 2V5_AFPGA_MOSI, sheet U_AFPGA_FMC2_bank2/2V5_AFPGA_MOSI
2V5_AFPGA_PROGRAM: port 2V5_AFPGA_PROGRAM, sheet U_AFPGA_FMC2_bank2/2V5_AFPGA_PROGRAM
AFPGA_DONE: port AFPGA_DONE, sheet U_AFPGA_FMC2_bank2/AFPGA_DONE
AFPGA_M0: port AFPGA_M0, sheet U_AFPGA_FMC2_bank2/AFPGA_M0
AFPGA_M1: port AFPGA_M1, sheet U_AFPGA_FMC2_bank2/AFPGA_M1
CLK20_VCXO: port CLK20_VCXO, sheet U_AFPGA/CLK20_VCXO
FMC1_CLK0M2C_N: port FMC1_Clk0M2C_N, sheet U_AFPGA_FMC1_bank0/FMC1_Clk0M2C_N
FMC1_CLK0M2C_P: port FMC1_Clk0M2C_P, sheet U_AFPGA_FMC1_bank0/FMC1_Clk0M2C_P
FMC1_CLK1M2C_N: port FMC1_Clk1M2C_N, sheet U_AFPGA_FMC1_bank0/FMC1_Clk1M2C_N
FMC1_CLK1M2C_P: port FMC1_Clk1M2C_P, sheet U_AFPGA_FMC1_bank0/FMC1_Clk1M2C_P
FMC1_PGC2M: port FMC1_PGC2M, sheet U_AFPGA/FMC1_PGC2M
FMC1_PRSNTM2C_N: port FMC1_PrsntM2C_N, sheet U_AFPGA/FMC1_PrsntM2C_N
FMC1_SCL: port FMC1_SCL, sheet U_AFPGA/FMC1_SCL
FMC1_SDA: port FMC1_SDA, sheet U_AFPGA/FMC1_SDA
FMC1_TCK: port FMC1_TCK, sheet U_AFPGA/FMC1_TCK
FMC1_TDI: port FMC1_TDI, sheet U_AFPGA/FMC1_TDI
FMC1_TDO: port FMC1_TDO, sheet U_AFPGA/FMC1_TDO
FMC1_TMS: port FMC1_TMS, sheet U_AFPGA/FMC1_TMS
FMC1_VREFAM2C: port FMC1_VREFAM2C, sheet U_AFPGA_FMC1_bank0/FMC1_VREFAM2C
FMC2_CLK0M2C_N: port FMC2_Clk0M2C_N, sheet U_AFPGA_FMC2_bank2/FMC2_Clk0M2C_N
FMC2_CLK0M2C_P: port FMC2_Clk0M2C_P, sheet U_AFPGA_FMC2_bank2/FMC2_Clk0M2C_P
FMC2_CLK1M2C_N: port FMC2_Clk1M2C_N, sheet U_AFPGA_FMC2_bank2/FMC2_Clk1M2C_N
FMC2_CLK1M2C_P: port FMC2_Clk1M2C_P, sheet U_AFPGA_FMC2_bank2/FMC2_Clk1M2C_P
FMC2_PGC2M: port FMC2_PGC2M, sheet U_AFPGA/FMC2_PGC2M
FMC2_PRSNTM2C_N: port FMC2_PrsntM2C_N, sheet U_AFPGA/FMC2_PrsntM2C_N
FMC2_SCL: port FMC2_SCL, sheet U_AFPGA/FMC2_SCL
FMC2_SDA: port FMC2_SDA, sheet U_AFPGA/FMC2_SDA
FMC2_TCK: port FMC2_TCK, sheet U_AFPGA/FMC2_TCK
FMC2_TDI: port FMC2_TDI, sheet U_AFPGA/FMC2_TDI
FMC2_TDO: port FMC2_TDO, sheet U_AFPGA/FMC2_TDO
FMC2_TMS: port FMC2_TMS, sheet U_AFPGA/FMC2_TMS
FMC2_VREFAM2C: port FMC2_VREFAM2C, sheet U_AFPGA_FMC2_bank2/FMC2_VREFAM2C
FPGA_CLK_N: port FPGA_CLK_N, sheet U_AFPGA/FPGA_CLK_N
FPGA_CLK_P: port FPGA_CLK_P, sheet U_AFPGA/FPGA_CLK_P
FPGPIO1_A2B: port FPGPIO1_A2B, sheet U_AFPGA/FPGPIO1_A2B
FPGPIO2_A2B: port FPGPIO2_A2B, sheet U_AFPGA/FPGPIO2_A2B
FPGPIO34_A2B: port FPGPIO34_A2B, sheet U_AFPGA/FPGPIO34_A2B
IO7: port IO7, sheet U_AFPGA/IO7
NOGA0: port NOGA0, sheet U_AFPGA/NOGA0
NOGA1: port NOGA1, sheet U_AFPGA/NOGA1
NOGA2: port NOGA2, sheet U_AFPGA/NOGA2
NOGA3: port NOGA3, sheet U_AFPGA/NOGA3
NOGA4: port NOGA4, sheet U_AFPGA/NOGA4
OE_SI57X: port OE_SI57X, sheet U_AFPGA/OE_SI57X
PLL20DAC_DIN: port PLL20DAC_DIN, sheet U_AFPGA/PLL20DAC_DIN
PLL20DAC_SCLK: port PLL20DAC_SCLK, sheet U_AFPGA/PLL20DAC_SCLK
PLL20DAC_SYNC_N: port PLL20DAC_SYNC_N, sheet U_AFPGA/PLL20DAC_SYNC_N
PLL25DAC_DIN: port PLL25DAC_DIN, sheet U_AFPGA/PLL25DAC_DIN
PLL25DAC_SCLK: port PLL25DAC_SCLK, sheet U_AFPGA/PLL25DAC_SCLK
PLL25DAC_SYNC_N: port PLL25DAC_SYNC_N, sheet U_AFPGA/PLL25DAC_SYNC_N
PLL_2AFPGA_N: port PLL_2AFPGA_N, sheet U_AFPGA/PLL_2AFPGA_N
PLL_2AFPGA_P: port PLL_2AFPGA_P, sheet U_AFPGA/PLL_2AFPGA_P
PUSHBUTTON: port PUSHBUTTON, sheet U_AFPGA/PUSHBUTTON
RST_N: port RST_N, sheet U_AFPGA/RST_N
SCL_AFPGA: port SCL_AFPGA, sheet U_AFPGA/SCL_AFPGA
SDA_AFPGA: port SDA_AFPGA, sheet U_AFPGA/SDA_AFPGA
SI57X_CLK_N: port SI57X_CLK_N, sheet U_AFPGA/SI57X_CLK_N
SI57X_CLK_P: port SI57X_CLK_P, sheet U_AFPGA/SI57X_CLK_P
SI57X_SCL: port SI57X_SCL, sheet U_AFPGA/SI57X_SCL
SI57X_SDA: port SI57X_SDA, sheet U_AFPGA/SI57X_SDA
SI57X_TUNE: port SI57X_TUNE, sheet U_AFPGA/SI57X_TUNE
SWITCH0: port SWITCH0, sheet U_AFPGA/SWITCH0
SWITCH1: port SWITCH1, sheet U_AFPGA/SWITCH1
UART_RXD: port UART_RXD, sheet U_AFPGA/UART_RXD
UART_TXD: port UART_TXD, sheet U_AFPGA/UART_TXD
USB_CLKOUT: port USB_CLKOUT, sheet U_AFPGA/USB_CLKOUT
USB_OE_N: port USB_OE_N, sheet U_AFPGA/USB_OE_N
USB_RD_N: port USB_RD_N, sheet U_AFPGA/USB_RD_N
USB_RXF_N: port USB_RXF_N, sheet U_AFPGA/USB_RXF_N
USB_SIWUA: port USB_SIWUA, sheet U_AFPGA/USB_SIWUA
USB_TXE_N: port USB_TXE_N, sheet U_AFPGA/USB_TXE_N
USB_WR_N: port USB_WR_N, sheet U_AFPGA/USB_WR_N
USEGA: port USEGA, sheet U_AFPGA/USEGA
VME_A_DIR: port VME_A_DIR, sheet U_AFPGA/VME_A_DIR
VME_A_OE_N: port VME_A_OE_N, sheet U_AFPGA/VME_A_OE_N
VME_AS_N: port VME_AS_N, sheet U_AFPGA/VME_AS_N
VME_BERR_N: port VME_BERR_N, sheet U_AFPGA/VME_BERR_N
VME_D_DIR: port VME_D_DIR, sheet U_AFPGA/VME_D_DIR
VME_D_OE_N: port VME_D_OE_N, sheet U_AFPGA/VME_D_OE_N
VME_DS1_N: port VME_DS1_N, sheet U_AFPGA/VME_DS1_N
VME_DS2_N: port VME_DS2_N, sheet U_AFPGA/VME_DS2_N
VME_DTACK_N: port VME_DTACK_N, sheet U_AFPGA/VME_DTACK_N
VME_DTACK_OE: port VME_DTACK_OE, sheet U_AFPGA/VME_DTACK_OE
VME_GAP: port VME_GAP, sheet U_AFPGA/VME_GAP
VME_IACK_N: port VME_IACK_N, sheet U_AFPGA/VME_IACK_N
VME_IACKIN_N: port VME_IACKIN_N, sheet U_AFPGA/VME_IACKIN_N
VME_IACKOUT_N: port VME_IACKOUT_N, sheet U_AFPGA/VME_IACKOUT_N
VME_LWORD_N: port VME_LWORD_N, sheet U_AFPGA/VME_LWORD_N
VME_RETRY_N: port VME_RETRY_N, sheet U_AFPGA/VME_RETRY_N
VME_RETRY_OE: port VME_RETRY_OE, sheet U_AFPGA/VME_RETRY_OE
VME_SYSCLK: port VME_SYSCLK, sheet U_AFPGA/VME_SYSCLK
VME_SYSRESET_N: port VME_SYSRESET_N, sheet U_AFPGA/VME_SYSRESET_N
VME_WRITE_N: port VME_WRITE_N, sheet U_AFPGA/VME_WRITE_N
WR_LOS: port WR_LOS, sheet U_AFPGA/WR_LOS
WR_MODDEF0: port WR_MODDEF0, sheet U_AFPGA/WR_MODDEF0
WR_MODDEF1: port WR_MODDEF1, sheet U_AFPGA/WR_MODDEF1
WR_MODDEF2: port WR_MODDEF2, sheet U_AFPGA/WR_MODDEF2
WR_RATESELECT: port WR_RATESELECT, sheet U_AFPGA/WR_RATESELECT
WR_TXDISABLE: port WR_TXDISABLE, sheet U_AFPGA/WR_TXDISABLE
WR_TXFAULT: port WR_TXFAULT, sheet U_AFPGA/WR_TXFAULT

### Buses and harness runs
bus P2_DATA_N[19..0] = port P2_DATA_N[19..0]
bus P2_DATA_P[19..0] = port P2_DATA_P[19..0]
bus port FMC1_La_N[33..0] = sheet U_AFPGA_FMC1_bank0/FMC1_La_N[33..0]
bus port FMC1_La_P[33..0] = sheet U_AFPGA_FMC1_bank0/FMC1_La_P[33..0]
bus port FMC2_La_N[33..0] = sheet U_AFPGA_FMC2_bank2/FMC2_La_N[33..0]
bus port FMC2_La_P[33..0] = sheet U_AFPGA_FMC2_bank2/FMC2_La_P[33..0]
bus port FP_GPIO[4..1] = sheet U_AFPGA/FP_GPIO[4..1]
bus port FP_LEDN[7..0] = sheet U_AFPGA/FP_LEDN[7..0]
bus port RSVD[7..0] = sheet U_AFPGA/RSVD[7..0]
bus port TERM_EN[4..1] = sheet U_AFPGA/TERM_EN[4..1]
bus port USB_D[7..0] = sheet U_AFPGA/USB_D[7..0]
bus port VME_A[31..1] = sheet U_AFPGA/VME_A[31..1]
bus port VME_AM[5..0] = sheet U_AFPGA/VME_AM[5..0]
bus port VME_D[31..0] = sheet U_AFPGA/VME_D[31..0]
bus port VME_GA[4..0] = sheet U_AFPGA/VME_GA[4..0]
bus port VME_IRQ[7..1] = sheet U_AFPGA/VME_IRQ[7..1]

### Notes on the sheet
- VCCO_1= 3.3V
- VCCO_3 = 3.3V
- VCCO_0 = 2.5V
- Copyright CERN 2011.
  This documentation describes Open Hardware and is licensed under the CERN  OHL v. 1.1. You may redistribute and modify this documentation under the   terms of the CERN OHL v.1.1. (http://ohwr.org/CERNOHL). This  documentation is distributed WITHOUT ANY EXPRESS OR IMPLIED  WARRANTY, INCLUDING OF MERCHANTABILITY, SATISFACTORY  QUALITY AND FITNESS FOR A PARTICULAR PURPOSE. Please see the  CERN OHL v.1.1 for applicable conditions.
- FMC1 control
- VME interface
- VCCO_2 = 2.5V
- FMC2 control
- USB
- front panel
- VCCO_5 = 1.5V
- DDR3 memory
- FPGA Bank 5 (1.5 V)
- user switch
- VCCO_4 = 1.5V
- FPGA Bank 4 (1.5 V)
- clock distribution
- Project/Equipment
- Document
- Designer
- Drawn by
- Check.by
- File
- Last Mod.
- Print Date
- Sheet
- Size
- A3
- of
- Rev

## Sheet AFPGA_FMC1_bank0.SchDoc: AFGA FMC1
size 420 x 297 mm; CheckedBy: T.Janicki; CompanyName: Creotech Instruments SA; DrawnBy: G.Kasprowicz; Organization: CERN; Address1: European Organization for Nuclear Research; Address2: CH-1211 Genève 23 - Switzerland; Revision: -; SheetNumber: 5; SheetTotal: 19; EDA_Number: EDA-xxxx; Projet: Simple VME FMC Carrier; ModifiedBy: -; CreateDate: 20/11/2012; CheckedDate: 23/01/2012; Title2: - bank 0 -; DivGrp: BE-CO; Designer: G.Kasprowicz; PageSetup: Record=PageOptions|CenterHorizontal=True|CenterVertical=True|PrintScale=0.95|XCorrection=1.00|YCorrection=1.00|PrintKind=1|BorderSize=5000000|LeftOffset=0|BottomOffset=0|Orientation=2|PaperLength=1000|PaperWidth=1000|Scale=100|PaperSource=15|PrintQuality=600|MediaType=1|DitherType=10|PaperKind=A3|PrintScaleMode=1; ModifiedDate: -
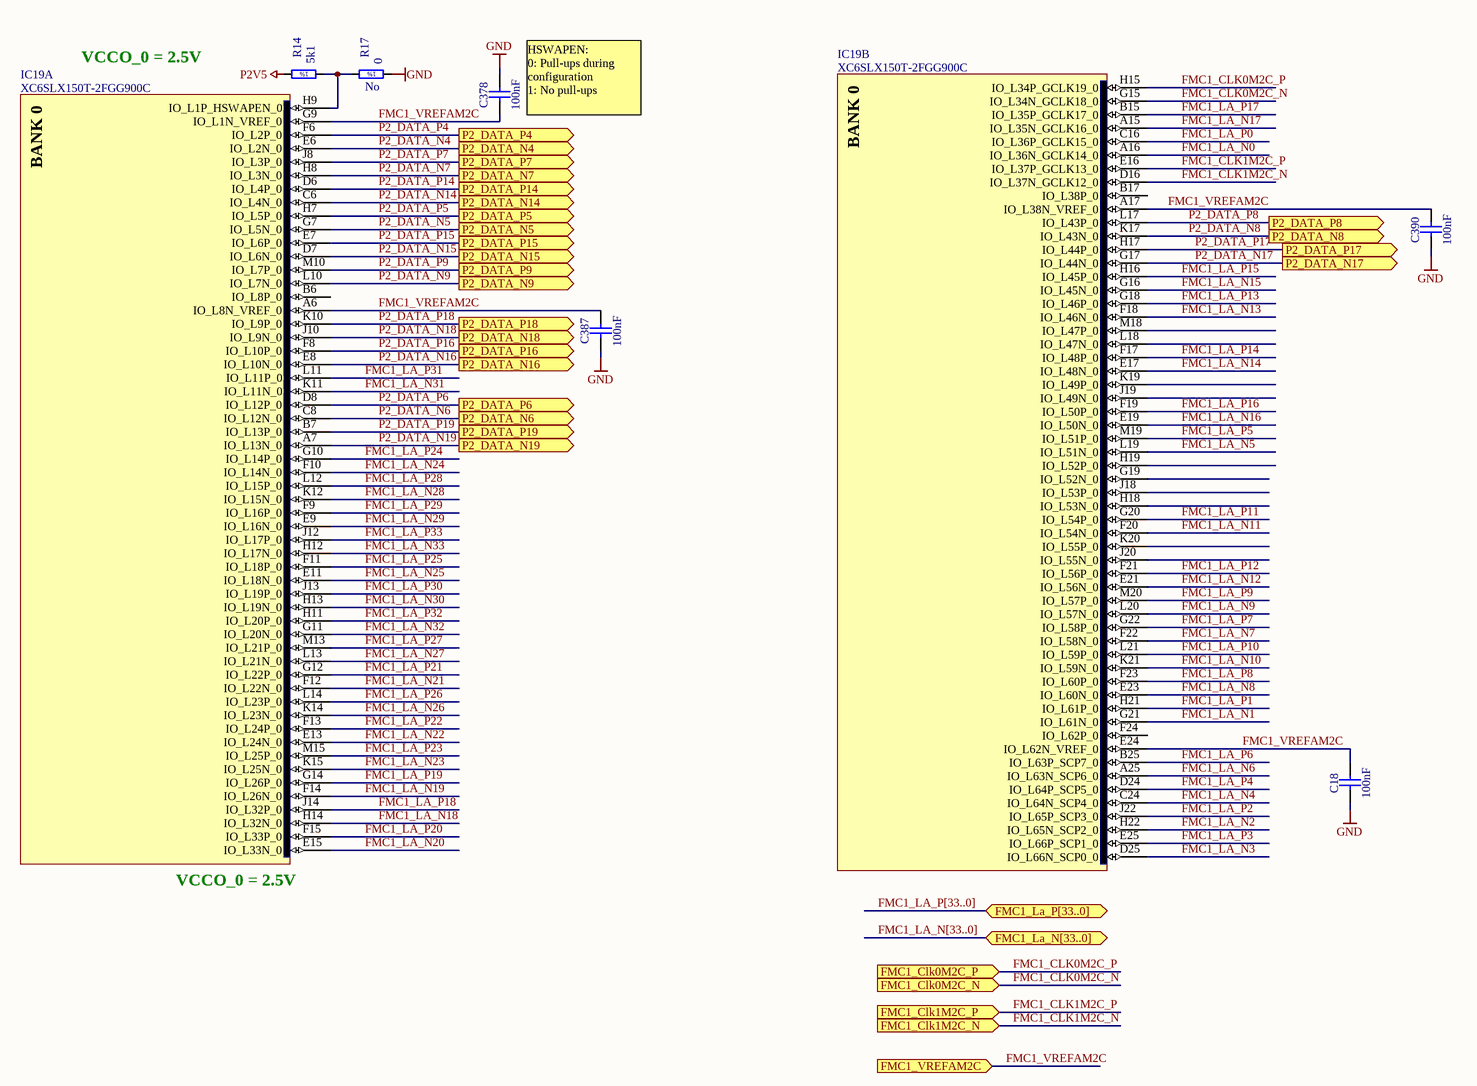
[diagram p8: AFPGA_FMC1_bank0.SchDoc]

### Parts
C18  100nF  [CAPC1005X55N]
C378  100nF  [CAPC1005X55N]
C387  100nF  [CAPC1005X55N]
C390  100nF  [CAPC1005X55N]
IC19  XC6SLX150T-2FGG900C  [BGA900C100P30X30_3100X3100X260]  (parts A,B of 18)
R14  5k1  [RESC1608X55N]
R17  0  Mounted: No  [RESC1608X55N]

### Ports
FMC1_Clk0M2C_N (in), FMC1_Clk0M2C_P (in), FMC1_Clk1M2C_N (in), FMC1_Clk1M2C_P (in), FMC1_La_N[33..0] (bidir), FMC1_La_P[33..0] (bidir), FMC1_VREFAM2C (in), P2_DATA_N4 (out), P2_DATA_N5 (out), P2_DATA_N6 (out), P2_DATA_N7 (out), P2_DATA_N8 (out), P2_DATA_N9 (out), P2_DATA_N14 (out), P2_DATA_N15 (out), P2_DATA_N16 (out), P2_DATA_N17 (out), P2_DATA_N18 (out), P2_DATA_N19 (out), P2_DATA_P4 (out), P2_DATA_P5 (out), P2_DATA_P6 (out), P2_DATA_P7 (out), P2_DATA_P8 (out), P2_DATA_P9 (out), P2_DATA_P14 (out), P2_DATA_P15 (out), P2_DATA_P16 (out), P2_DATA_P17 (out), P2_DATA_P18 (out), P2_DATA_P19 (out)

### Nets
GND: C18.1 C378.2 C387.1 C390.1 R17.1
P2V5: R14.2
FMC1_CLK0M2C_N: IC19.G15(IO_L34N_GCLK18_0) ; port FMC1_Clk0M2C_N
FMC1_CLK0M2C_P: IC19.H15(IO_L34P_GCLK19_0) ; port FMC1_Clk0M2C_P
FMC1_CLK1M2C_N: IC19.D16(IO_L37N_GCLK12_0) ; port FMC1_Clk1M2C_N
FMC1_CLK1M2C_P: IC19.E16(IO_L37P_GCLK13_0) ; port FMC1_Clk1M2C_P
FMC1_LA_N0: IC19.A16(IO_L36N_GCLK14_0)
FMC1_LA_N1: IC19.G21(IO_L61N_0)
FMC1_LA_N2: IC19.H22(IO_L65N_SCP2_0)
FMC1_LA_N3: IC19.D25(IO_L66N_SCP0_0)
FMC1_LA_N4: IC19.C24(IO_L64N_SCP4_0)
FMC1_LA_N5: IC19.L19(IO_L51N_0)
FMC1_LA_N6: IC19.A25(IO_L63N_SCP6_0)
FMC1_LA_N7: IC19.F22(IO_L58N_0)
FMC1_LA_N8: IC19.E23(IO_L60N_0)
FMC1_LA_N9: IC19.L20(IO_L57N_0)
FMC1_LA_N10: IC19.K21(IO_L59N_0)
FMC1_LA_N11: IC19.F20(IO_L54N_0)
FMC1_LA_N12: IC19.E21(IO_L56N_0)
FMC1_LA_N13: IC19.F18(IO_L46N_0)
FMC1_LA_N14: IC19.E17(IO_L48N_0)
FMC1_LA_N15: IC19.G16(IO_L45N_0)
FMC1_LA_N16: IC19.E19(IO_L50N_0)
FMC1_LA_N17: IC19.A15(IO_L35N_GCLK16_0)
FMC1_LA_N18: IC19.H14(IO_L32N_0)
FMC1_LA_N19: IC19.F14(IO_L26N_0)
FMC1_LA_N20: IC19.E15(IO_L33N_0)
FMC1_LA_N21: IC19.F12(IO_L22N_0)
FMC1_LA_N22: IC19.E13(IO_L24N_0)
FMC1_LA_N23: IC19.K15(IO_L25N_0)
FMC1_LA_N24: IC19.F10(IO_L14N_0)
FMC1_LA_N25: IC19.E11(IO_L18N_0)
FMC1_LA_N26: IC19.K14(IO_L23N_0)
FMC1_LA_N27: IC19.L13(IO_L21N_0)
FMC1_LA_N28: IC19.K12(IO_L15N_0)
FMC1_LA_N29: IC19.E9(IO_L16N_0)
FMC1_LA_N30: IC19.H13(IO_L19N_0)
FMC1_LA_N31: IC19.K11(IO_L11N_0)
FMC1_LA_N32: IC19.G11(IO_L20N_0)
FMC1_LA_N33: IC19.H12(IO_L17N_0)
FMC1_LA_P0: IC19.C16(IO_L36P_GCLK15_0)
FMC1_LA_P1: IC19.H21(IO_L61P_0)
FMC1_LA_P2: IC19.J22(IO_L65P_SCP3_0)
FMC1_LA_P3: IC19.E25(IO_L66P_SCP1_0)
FMC1_LA_P4: IC19.D24(IO_L64P_SCP5_0)
FMC1_LA_P5: IC19.M19(IO_L51P_0)
FMC1_LA_P6: IC19.B25(IO_L63P_SCP7_0)
FMC1_LA_P7: IC19.G22(IO_L58P_0)
FMC1_LA_P8: IC19.F23(IO_L60P_0)
FMC1_LA_P9: IC19.M20(IO_L57P_0)
FMC1_LA_P10: IC19.L21(IO_L59P_0)
FMC1_LA_P11: IC19.G20(IO_L54P_0)
FMC1_LA_P12: IC19.F21(IO_L56P_0)
FMC1_LA_P13: IC19.G18(IO_L46P_0)
FMC1_LA_P14: IC19.F17(IO_L48P_0)
FMC1_LA_P15: IC19.H16(IO_L45P_0)
FMC1_LA_P16: IC19.F19(IO_L50P_0)
FMC1_LA_P17: IC19.B15(IO_L35P_GCLK17_0)
FMC1_LA_P18: IC19.J14(IO_L32P_0)
FMC1_LA_P19: IC19.G14(IO_L26P_0)
FMC1_LA_P20: IC19.F15(IO_L33P_0)
FMC1_LA_P21: IC19.G12(IO_L22P_0)
FMC1_LA_P22: IC19.F13(IO_L24P_0)
FMC1_LA_P23: IC19.M15(IO_L25P_0)
FMC1_LA_P24: IC19.G10(IO_L14P_0)
FMC1_LA_P25: IC19.F11(IO_L18P_0)
FMC1_LA_P26: IC19.L14(IO_L23P_0)
FMC1_LA_P27: IC19.M13(IO_L21P_0)
FMC1_LA_P28: IC19.L12(IO_L15P_0)
FMC1_LA_P29: IC19.F9(IO_L16P_0)
FMC1_LA_P30: IC19.J13(IO_L19P_0)
FMC1_LA_P31: IC19.L11(IO_L11P_0)
FMC1_LA_P32: IC19.H11(IO_L20P_0)
FMC1_LA_P33: IC19.J12(IO_L17P_0)
FMC1_VREFAM2C: C18.2 C378.1 C387.2 C390.2 IC19.A6(IO_L8N_VREF_0) IC19.A17(IO_L38N_VREF_0) IC19.E24(IO_L62N_VREF_0) IC19.G9(IO_L1N_VREF_0) ; port FMC1_VREFAM2C
P2_DATA_N4: IC19.E6(IO_L2N_0) ; port P2_DATA_N4
P2_DATA_N5: IC19.G7(IO_L5N_0) ; port P2_DATA_N5
P2_DATA_N6: IC19.C8(IO_L12N_0) ; port P2_DATA_N6
P2_DATA_N7: IC19.H8(IO_L3N_0) ; port P2_DATA_N7
P2_DATA_N8: IC19.K17(IO_L43N_0) ; port P2_DATA_N8
P2_DATA_N9: IC19.L10(IO_L7N_0) ; port P2_DATA_N9
P2_DATA_N14: IC19.C6(IO_L4N_0) ; port P2_DATA_N14
P2_DATA_N15: IC19.D7(IO_L6N_0) ; port P2_DATA_N15
P2_DATA_N16: IC19.E8(IO_L10N_0) ; port P2_DATA_N16
P2_DATA_N17: IC19.G17(IO_L44N_0) ; port P2_DATA_N17
P2_DATA_N18: IC19.J10(IO_L9N_0) ; port P2_DATA_N18
P2_DATA_N19: IC19.A7(IO_L13N_0) ; port P2_DATA_N19
P2_DATA_P4: IC19.F6(IO_L2P_0) ; port P2_DATA_P4
P2_DATA_P5: IC19.H7(IO_L5P_0) ; port P2_DATA_P5
P2_DATA_P6: IC19.D8(IO_L12P_0) ; port P2_DATA_P6
P2_DATA_P7: IC19.J8(IO_L3P_0) ; port P2_DATA_P7
P2_DATA_P8: IC19.L17(IO_L43P_0) ; port P2_DATA_P8
P2_DATA_P9: IC19.M10(IO_L7P_0) ; port P2_DATA_P9
P2_DATA_P14: IC19.D6(IO_L4P_0) ; port P2_DATA_P14
P2_DATA_P15: IC19.E7(IO_L6P_0) ; port P2_DATA_P15
P2_DATA_P16: IC19.F8(IO_L10P_0) ; port P2_DATA_P16
P2_DATA_P17: IC19.H17(IO_L44P_0) ; port P2_DATA_P17
P2_DATA_P18: IC19.K10(IO_L9P_0) ; port P2_DATA_P18
P2_DATA_P19: IC19.B7(IO_L13P_0) ; port P2_DATA_P19
NetIC19_H9: IC19.H9(IO_L1P_HSWAPEN_0) R14.1 R17.2

Not connected (* = marked no-connect by the designer): IC19 B6(IO_L8P_0) B17(IO_L38P_0) F24(IO_L62P_0) G19(IO_L52N_0) H18(IO_L53N_0) H19(IO_L52P_0) J18(IO_L53P_0) J19(IO_L49N_0) J20(IO_L55N_0) K19(IO_L49P_0) K20(IO_L55P_0) L18(IO_L47N_0) M18(IO_L47P_0)

### Buses and harness runs
bus FMC1_LA_N[33..0] = port FMC1_La_N[33..0]
bus FMC1_LA_P[33..0] = port FMC1_La_P[33..0]

### Notes on the sheet
- VCCO_0 = 2.5V
- (near C378) HSWAPEN:
  0: Pull-ups during configuration
  1: No pull-ups
- (near IC19) VCCO_0 = 2.5V
- Project/Equipment
- Document
- Designer
- Drawn by
- Check.by
- File
- Last Mod.
- Print Date
- Sheet
- Size
- A3
- of
- Rev
- (in symbol R0603_0R_JUMPER) 1%
- (in symbol R0603_5K1_1%_0.1W_100PPM) 1%
- (in symbol XC6SLX150T-2FGG900C, part A) BANK 0
- (in symbol XC6SLX150T-2FGG900C, part B) BANK 0

### Library data of the parts
C18 C378 C387 C390 = CC0402_100NF_16V_10%_X7R: as C351 on sheet USB_interface; Part Number: CC0402_100NF_16V_10%_X7R; Component Kind: Standard; Component Type: Standard; Pin Count: 2; Value: 100nF; Status: Not Recommended; Manufacturer Part Number: CC0402_100NF_16V_10%_X7R; Case: 0402; Mounted: Yes; Socket: No; SMD: Yes; Manufacturer1 Example: PHYCOMP; Manufacturer1 ComponentHeight: 0.55mm; HelpURL: \\cern.ch\dfs\Applications\Altium\Datasheets\CC0402_X7R_PHYCOMP.pdf; Author: CERN DEM JLC; CreateDate: 03/12/2007; LatestRevisionDate: 03/12/2007
IC19 = XC6SLX150T-2FGG900C: SPARTAN-6, FPGA, 900-Ball BGA, Commercial Grade, Pb-Free; Part Description: SPARTAN-6, FPGA, 540 User I/Os, 8 GTPs, 900-Ball BGA, Commercial Grade, Pb-Free; Manufacturer: XILINX; Table: Logic; Part Number: XC6SLX150T-2FGG900C; Component Kind: Standard; Component Type: Standard; Device: XC6SLX150T-2FGG900C; PackageDescription: BGA,1.00mm pitch, square; 900 pin, 30 columns X 30 rows, 31.00mm X 31.00mm X 2.60mm H, IPC Medium Density; Manufacturer Part Number: XC6SLX150T-2FGG900C; Pin Count: 900; Case: BGA900; Mounted: Yes; Socket: No; SMD: Yes; ComponentHeight: 2.6mm; HelpURL: \\cern.ch\dfs\Applications\Altium\Datasheets\XC6SLX150T-2FGG900C.pdf; ComponentLink1URL: \\cern.ch\dfs\Applications\Altium\Datasheets\XC6SLX150T-2FGG900C_Package-Pinouts.pdf; ComponentLink1Description: Package/Pinouts; Author: CERN DEM JLC; CreateDate: 2009-11-17; LatestRevisionDate: 2009-11-17
R14 = R0603_5K1_1%_0.1W_100PPM: Resistor - 1%; Part Description: General Purpose Thick Film Chip Resistor; Manufacturer: GENERIC; Manufacturer1 Part Number: NRC06F5101TRF; Power: 0.1W; TC: ±100ppm/°C; Table: Resistors SMD; Part Number: R0603_5K1_1%_0.1W_100PPM; Component Kind: Standard; Component Type: Standard; Pin Count: 2; Value: 5k1; Status: Preferred; Tolerance: ±1%; Manufacturer Part Number: R0603_5K1_1%_0.1W_100PPM; Case: 0603; Mounted: Yes; Socket: No; SMD: Yes; Manufacturer1 Example: NIC COMPONENT; Manufacturer1 ComponentHeight: 0.55mm; HelpURL: \\cern.ch\dfs\Applications\Altium\Datasheets\R0603_NIC_NRC.pdf; Author: CERN DEM JLC; CreateDate: 03/12/2007; LatestRevisionDate: 13/03/2008
R17 = R0603_0R_JUMPER: as R121 on sheet USB_interface; Part Number: R0603_0R_JUMPER; Component Kind: Standard; Component Type: Standard; Pin Count: 2; Value: 0; Status: Preferred; Manufacturer Part Number: R0603_0R_JUMPER; Case: 0603; Socket: No; SMD: Yes; Manufacturer1 Example: NIC COMPONENT; Manufacturer1 ComponentHeight: 0.55mm; HelpURL: \\cern.ch\dfs\Applications\Altium\Datasheets\R0603_NIC_NRC.pdf; Author: CERN DEM JLC; CreateDate: 12/3/2007; LatestRevisionDate: 3/13/2008